# EAGLE design power_sense_v2 (EAGLE 5.12)
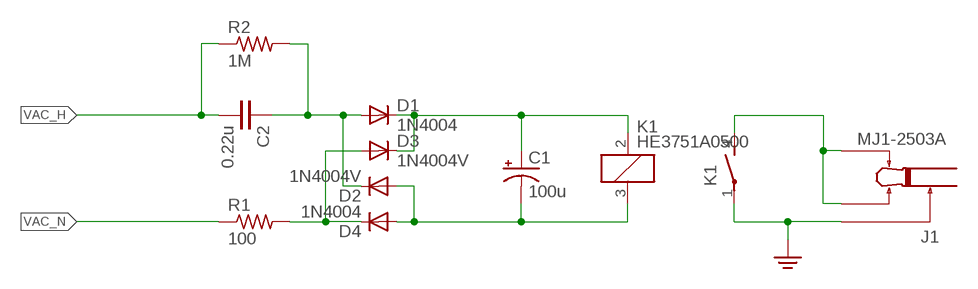
[diagram p0: schematic, sheet 1]

## Parts
C1  100u  C-AL-E2,5-7H  [E2,5-7H]
C2  0.22u  C-CER-10P3  [C075-032X103]
D1  1N4004  [DO41-10]
D2  1N4004V  [0309V]
D3  1N4004V  [0309V]
D4  1N4004  [DO41-10]
J1  MJ1-2503A  [MJ1-2503A]
K1  HE3751A0500  [HE3751]
R1  100  R-12  [0309/12]
R2  1M  R-204V  [0204V]

## Nets
GND: J1.1(GND) K1.1(2:P)
N$1: J1.2(MONO) J1.3(MONO) K1.4(2:S)
N$2: C1.- D2.1(A) D4.A K1.3
N$3: D3.1(A) D4.C R1.2
N$4: C1.+ D1.C D3.2(C) K1.2
N$5: C2.1 D1.A D2.2(C) R2.2
VAC_H: C2.2 R2.1
VAC_N: R1.1

## Library data of the parts
C1 = aim-passives:C-AL
C2 = aim-passives:C-CER
D1-D4 = aim-diodes:1N4004: DIODE general purpose rectifier, 1 A
J1 = aim-connectors:MJ1-2503A
K1 = aim-switch:HE3751A0500: RELAY reed, 1 x norm. open, 7.62 mm, grid 5.08 mm, Hamlin; MF: HAMLIN
R1 R2 = aim-passives:R

## Board
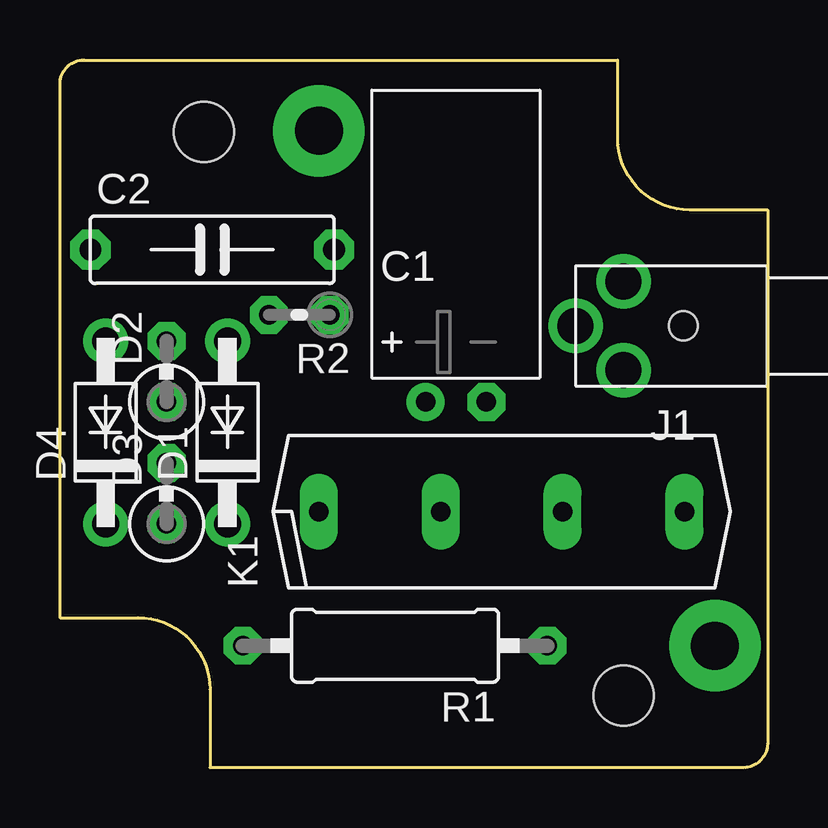
[diagram p1: board, top side]
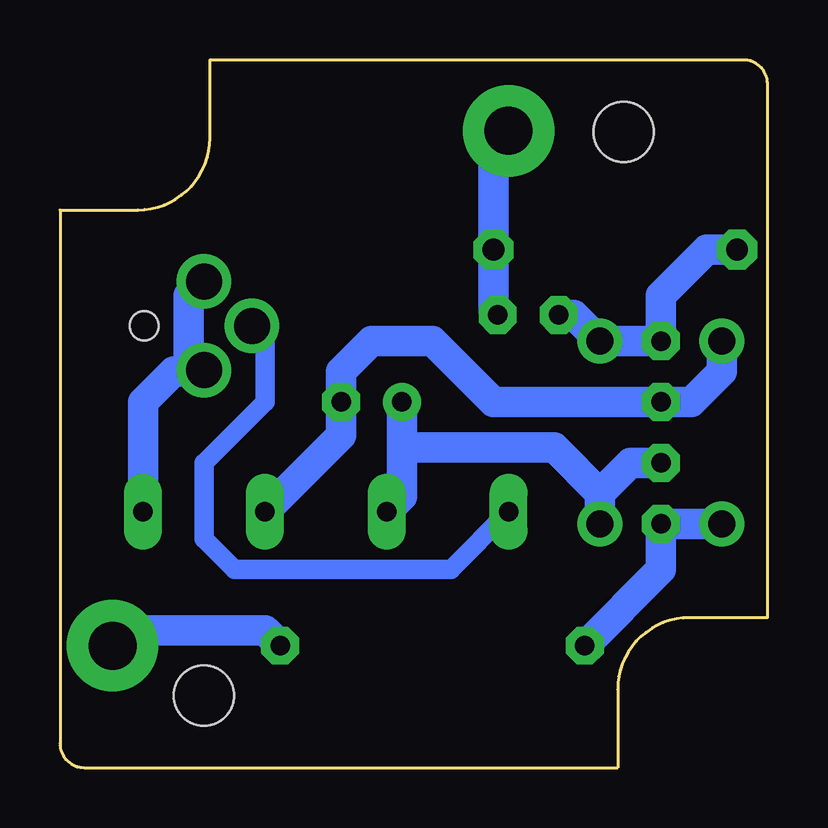
[diagram p2: board, bottom side, seen from below]

Size 29.5 x 29.5 mm. Coordinates in mm from the lower left corner, seen from the top.
Copper layers (1*16): Top 0.035mm / dielectric 1.15mm / Bottom 0.035mm
Design rules "Photoetch": minimum track width 10mil, minimum drill 18mil, track to track 5mil, track to pad 5mil, pad to pad 5mil, via to via 5mil, smd to smd 5mil, copper to edge 50mil, drill to drill 10mil, minimum pad ring 15mil, minimum via ring 15mil, stop-mask expansion 4mil, vias tented up to drill 0mil, thermal gap 10mil
tRestrict: area 21.6,1 to 25.4,4.9; area 4.1,24.6 to 7.9,28.4

### Footprints (pad centres in the part's own frame; a part is rotated, then mirrored left to right if it is on the bottom)
E2,5-7H = drill 0.813 pad 1.6 round: + -1.27,0 | drill 0.813 pad 1.6 octagon: - 1.27,0
C075-032X103 = drill 0.914 octagon: 1 -5.08,0; 2 5.08,0
DO41-10 = drill 1.118 round: A 3.81,0; C -3.81,0
0309V = drill 0.813 octagon: 1 -1.27,0; 2 1.27,0
MJ1-2503A = drill 1.5 round: 1 2,0; 2 0,-1.85; 3 0,1.85 | hole 1.2: -2.5,0
HE3751 = drill 0.813 long: 1 -7.62,0; 2 -2.54,0; 3 2.54,0; 4 7.62,0
0309/12 = drill 0.813 octagon: 1 -6.35,0; 2 6.35,0
0204V = drill 0.813 octagon: 1 -1.27,0; 2 1.27,0
1551NFL = hole 2.5: 6,26.5; 23.5,3

### Placement (x,y rotation side)
C1  16.51,15.24 0 top
C2  6.35,21.59 0 top
D1  6.99,13.97 90 top
D2  4.45,16.51 90 top
D3  4.45,11.43 90 top
D4  1.91,13.97 90 top
J1  23.5,18.41 180 top
K1  18.41,10.67 0 top
R1  13.97,5.08 180 top
R2  9.98,18.87 180 top
U$1  [1551NFL]  0,0 0 top

### Tracks (layer width: path | path; a pad name or v marks a point on that pad's centre or on a via)
GND
  Bottom 0.813: J1.1 21.5,18.32 20.95,17.78 20.95,15.24 23.5,12.7 23.5,9.53 22.23,8.26 13.21,8.26 K1.1
N$1
  Bottom 1.27: J1.2 23.55,20.27 24.13,19.68 24.13,17.2 J1.3 23.55,16.51 24.77,16.51 26.04,15.24 K1.4
N$2
  Bottom 1.27: D4.A 1.91,16.51 3.17,15.24 D2.1 11.43,15.24 13.97,17.78 16.51,17.78 17.78,16.51 C1.- 17.78,13.84 K1.3
N$3
  Bottom 1.27: R1.2 4.45,8.26 D3.1 D4.C
N$4
  Bottom 1.27: 15.24,13.34 C1.+ | D3.2 5.71,12.7 6.99,11.43 | D1.C 6.99,11.43 | 6.99,11.43 8.89,13.34 15.24,13.34 | K1.2 15.24,11.3 15.24,13.34
N$5
  Bottom 1.27: R2.2 8.08,18.87 D1.A D2.2 4.45,19.68 2.54,21.59 C2.1
VAC_H  (via drill 2 pad 3.81)
  Bottom 1.27: R2.1 11.43,19.05 C2.2 11.43,25.91 v10.79,26.54
VAC_N  (via drill 2 pad 3.81)
  Bottom 1.27: R1.1 20.95,5.71 26.67,5.71 v27.3,5.08

### Text on the board
_tPlace: Alex Mykyta | 2015-12
_tNames: Q1 | R1 | J1 | NE1